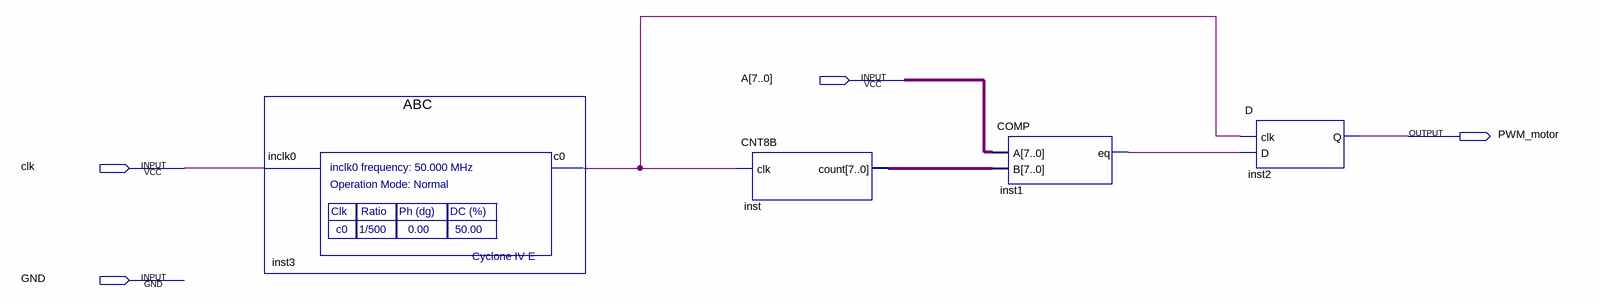
[diagram p0: schematic sheet]
// Quartus schematic PWM.bdf as structural Verilog: 4 symbols, 4 pins
module PWM (
  input  [7:0] A,
  input  clk,
  input  GND,
  output PWM_motor
);

  wire inst1_eq, inst3_c0;
  wire [7:0] inst_count;

  ABC inst3 (.inclk0(clk), .c0(inst3_c0));
  CNT8B inst (.clk(inst3_c0), .count(inst_count));
  COMP inst1 (.A(A), .B(inst_count), .eq(inst1_eq));
  D inst2 (.clk(inst3_c0), .D(inst1_eq), .Q(PWM_motor));
endmodule
